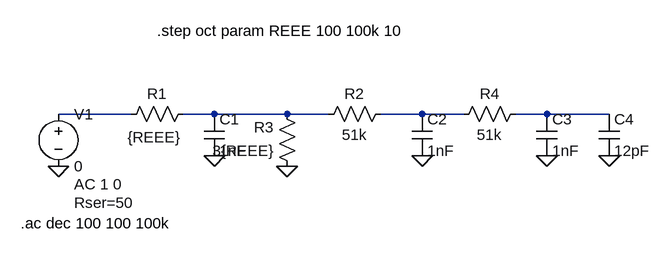
[diagram p0: schematic oldFilter.asc]
oldFilter.asc, the LTspice schematic file:
Version 4
SHEET 1 880 680
WIRE 48 176 -64 176
WIRE 176 176 128 176
WIRE 288 176 176 176
WIRE 352 176 288 176
WIRE 496 176 432 176
WIRE 560 176 496 176
WIRE 688 176 640 176
WIRE 784 176 688 176
FLAG 688 240 0
FLAG 496 240 0
FLAG 288 256 0
FLAG 176 240 0
FLAG -64 256 0
FLAG 784 240 0
SYMBOL voltage -64 160 R0
WINDOW 123 24 124 Left 2
WINDOW 39 24 152 Left 2
SYMATTR InstName V1
SYMATTR Value 0
SYMATTR Value2 AC 1 0
SYMATTR SpiceLine Rser=50
SYMBOL res 144 160 R90
WINDOW 0 0 56 VBottom 2
WINDOW 3 36 61 VTop 2
SYMATTR InstName R1
SYMATTR Value {REEE}
SYMBOL cap 160 176 R0
SYMATTR InstName C1
SYMATTR Value 1nF
SYMBOL res 448 160 R90
WINDOW 0 0 56 VBottom 2
WINDOW 3 32 56 VTop 2
SYMATTR InstName R2
SYMATTR Value 51k
SYMBOL res 304 272 R180
WINDOW 0 36 76 Left 2
WINDOW 3 36 40 Left 2
SYMATTR InstName R3
SYMATTR Value 3{REEE}
SYMBOL cap 480 176 R0
SYMATTR InstName C2
SYMATTR Value 1nF
SYMBOL res 656 160 R90
WINDOW 0 0 56 VBottom 2
WINDOW 3 32 56 VTop 2
SYMATTR InstName R4
SYMATTR Value 51k
SYMBOL cap 672 176 R0
SYMATTR InstName C3
SYMATTR Value 1nF
SYMBOL cap 768 176 R0
SYMATTR InstName C4
SYMATTR Value 12pF
TEXT -122 344 Left 2 !.ac dec 100 100 100k
TEXT 88 48 Left 2 !.step oct param REEE 100 100k 10

The netlist it stands for:
* oldFilter.asc
V1 N001 0 0 AC 1 0 Rser=50
R1 N002 N001 {REEE}
C1 N002 0 1nF
R2 N003 N002 51k
R3 0 N002 3{REEE}
C2 N003 0 1nF
R4 N004 N003 51k
C3 N004 0 1nF
C4 N004 0 12pF
.ac dec 100 100 100k
.step oct param REEE 100 100k 10
.backanno
.end